# Altium schematic sheet S7CAS-PLEIADES-CARTE-MERE_P20_INFO.SchDoc
size Tabloid; SheetNumber: 21; SheetTotal: 21; Sheet_Name: Insert name in Document Parameters; Size: 11x17
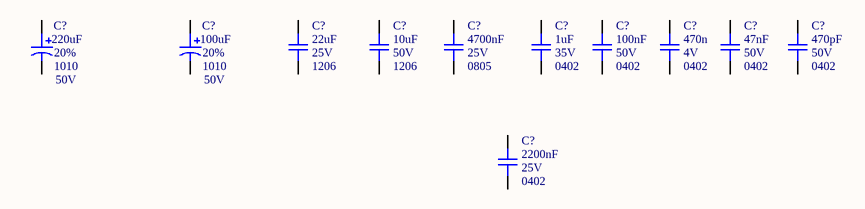
[diagram p0: S7CAS-PLEIADES-CARTE-MERE_P20_INFO.SchDoc]

## Parts
(Parts that share a designator on the sheet are numbered #1, #2 ... from top to bottom, then left to right.)
C?#1  value 220uF  Voltage: 50V  Package: 1010  Precision: 20%  [CAP_ALU_1010_vishay]  (hidden comment: MAL215099101E3)
C?#2  value 100uF  Voltage: 50V  Package: 1010  Precision: 20%  [CAP_ALU_1010_vishay]  (hidden comment: MAL215099101E3)
C?#3  value 22uF  Voltage: 25V  Package: 1206  [CAP_1206]  (hidden comment: CAP - 1206)
C?#4  value 10uF  Voltage: 50V  Package: 1206  [CAP_1206]  (hidden comment: CAP - 1206)
C?#5  value 4700nF  Voltage: 25V  Package: 0805  [CAP_0805]  (hidden comment: CAP - 0805)
C?#6  value 1uF  Voltage: 35V  Package: 0402  [CAP_0402]  (hidden comment: CAP - 0402)
C?#7  value 100nF  Voltage: 50V  Package: 0402  [CAP_0402]  (hidden comment: CAP - 0402)
C?#8  value 470n  Voltage: 4V  Package: 0402  [CAP_0402]  (hidden comment: CAP - 0402)
C?#9  value 47nF  Voltage: 50V  Package: 0402  [CAP_0402]  (hidden comment: CAP - 0402)
C?#10  value 470pF  Voltage: 50V  Package: 0402  [CAP_0402]  (hidden comment: CAP - 0402)
C?#11  value 2200nF  Voltage: 25V  Package: 0402  [CAP_0402]  (hidden comment: CAP - 0402)

## Nets

Not connected (* = marked no-connect by the designer): C?#1 1 2; C?#2 1 2; C?#3 1 2; C?#4 1 2; C?#5 1 2; C?#6 1 2; C?#7 1 2; C?#8 1 2; C?#9 1 2; C?#10 1 2; C?#11 1 2

## Notes on the sheet
- Sheet Name
- Project Title
- Global Project
- Size
- Group
- Revision
- Date
- Sheet
- of
- Filename
- Designers

## Library data of the parts
C?#1 C?#2 = CAP_ALU_MAL215099101E3: CAP - ALU 100uF 20% 50V - 1010; Current: 490mA; Mfg: Vishay Dale; Mfg Part Number: MAL215099101E3; HelpURL: http://www.vishay.com/docs/28395/150crz.pdf; CreatedBy: Jonathan Bouchard; Temperature: -55°C to 125°C; Power: *; Supplier 1: Digikey; Supplier Part Number 1: 4399PHDKR-ND
C?#3 = CAP - 1206: Mfg Part Number: GRM31CC81E226KE11; Precision: 10%; Current: *; HelpURL: https://search.murata.co.jp/Ceramy/image/img/A01X/G101/ENG/GRM31CD71H106KE11-01A.pdf; CreatedBy: Jonathan Bouchard; Power: *
C?#4 = CAP - 1206: Mfg Part Number: GRM31CD71H106KE11; Precision: 10%; Current: *; HelpURL: https://search.murata.co.jp/Ceramy/image/img/A01X/G101/ENG/GRM31CD71H106KE11-01A.pdf; CreatedBy: Jonathan Bouchard; Power: *
C?#5 = CAP - 0805: Mfg Part Number: GRM219R61E475KA73; Precision: 10%; Current: *; CreatedBy: Jonathan Bouchard; Power: *
C?#6 = CAP - 0402: Mfg Part Number: GRM155R6YA105KE11; Precision: 10%; Current: *; CreatedBy: Jonathan Bouchard; Power: *
C?#7 = CAP - 0402: Mfg Part Number: GRM155R61H104KE14; Precision: 10%; Current: *; CreatedBy: Jonathan Bouchard; Power: *
C?#8 = CAP - 0402: Mfg Part Number: GXT155R61C474KE01; Precision: 10%; Current: *; CreatedBy: Jonathan Bouchard; Power: *
C?#9 = CAP - 0402: Mfg Part Number: GRM155R61H473KE14; Precision: 10%; Current: *; CreatedBy: Jonathan Bouchard; Power: *
C?#10 = CAP - 0402: Mfg Part Number: GRM1555C1H471GA01; Precision: 2%; Current: *; HelpURL: https://search.murata.co.jp/Ceramy/image/img/A01X/G101/ENG/GRM1555C1H471GA01-01.pdf; CreatedBy: Jonathan Bouchard; Power: *
C?#11 = CAP - 0402: Mfg Part Number: GRM155R61E225KE11; Precision: 10%; Current: *; CreatedBy: Jonathan Bouchard; Power: *